# Altium schematic sheet APM9328_CONNECTORL.SchDoc: CONNECTOR L
size A4; Author: NC; Revision: 1.0; SheetNumber: 7; SheetTotal: 14
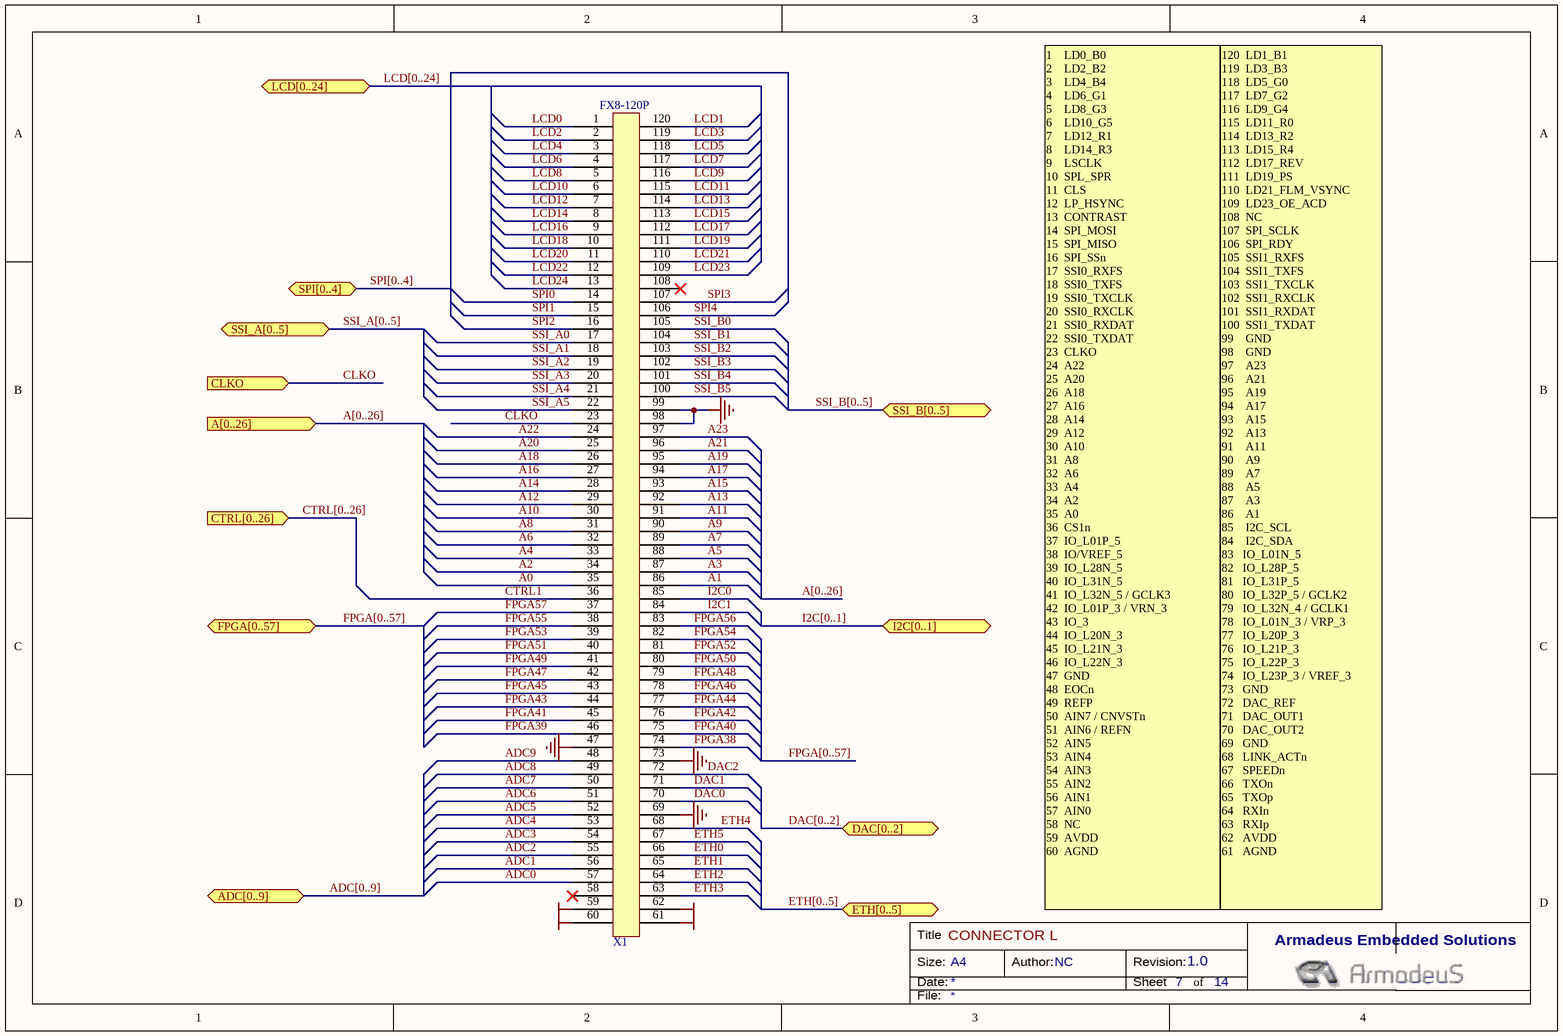
[diagram p0: APM9328_CONNECTORL.SchDoc]

## Parts
X1  FX8-120P  [FX8-120P]

## Ports
A[0..26] (in), ADC[0..9] (bidir), CLKO (in), CTRL[0..26] (in), DAC[0..2] (bidir), ETH[0..5] (bidir), FPGA[0..57] (bidir), I2C[0..1] (bidir), LCD[0..24] (bidir), SPI[0..4] (bidir), SSI_A[0..5] (bidir), SSI_B[0..5] (bidir)

## Nets
AGND: X1.60 X1.61
AVDD: X1.59 X1.62
GND: X1.47 X1.69 X1.73 X1.98 X1.99
A0: X1.35
A1: X1.86
A2: X1.34
A3: X1.87
A4: X1.33
A5: X1.88
A6: X1.32
A7: X1.89
A8: X1.31
A9: X1.90
A10: X1.30
A11: X1.91
A12: X1.29
A13: X1.92
A14: X1.28
A15: X1.93
A16: X1.27
A17: X1.94
A18: X1.26
A19: X1.95
A20: X1.25
A21: X1.96
A22: X1.24
A23: X1.97
ADC0: X1.57
ADC1: X1.56
ADC2: X1.55
ADC3: X1.54
ADC4: X1.53
ADC5: X1.52
ADC6: X1.51
ADC7: X1.50
ADC8: X1.49
ADC9: X1.48
CLKO: X1.23 ; port CLKO
CTRL1: X1.36
DAC0: X1.70
DAC1: X1.71
DAC2: X1.72
ETH0: X1.66
ETH1: X1.65
ETH2: X1.64
ETH3: X1.63
ETH4: X1.68
ETH5: X1.67
FPGA38: X1.74
FPGA39: X1.46
FPGA40: X1.75
FPGA41: X1.45
FPGA42: X1.76
FPGA43: X1.44
FPGA44: X1.77
FPGA45: X1.43
FPGA46: X1.78
FPGA47: X1.42
FPGA48: X1.79
FPGA49: X1.41
FPGA50: X1.80
FPGA51: X1.40
FPGA52: X1.81
FPGA53: X1.39
FPGA54: X1.82
FPGA55: X1.38
FPGA56: X1.83
FPGA57: X1.37
I2C0: X1.85
I2C1: X1.84
LCD0: X1.1
LCD1: X1.120
LCD2: X1.2
LCD3: X1.119
LCD4: X1.3
LCD5: X1.118
LCD6: X1.4
LCD7: X1.117
LCD8: X1.5
LCD9: X1.116
LCD10: X1.6
LCD11: X1.115
LCD12: X1.7
LCD13: X1.114
LCD14: X1.8
LCD15: X1.113
LCD16: X1.9
LCD17: X1.112
LCD18: X1.10
LCD19: X1.111
LCD20: X1.11
LCD21: X1.110
LCD22: X1.12
LCD23: X1.109
LCD24: X1.13
SPI0: X1.14
SPI1: X1.15
SPI2: X1.16
SPI3: X1.107
SPI4: X1.106
SSI_A0: X1.17
SSI_A1: X1.18
SSI_A2: X1.19
SSI_A3: X1.20
SSI_A4: X1.21
SSI_A5: X1.22
SSI_B0: X1.105
SSI_B1: X1.104
SSI_B2: X1.103
SSI_B3: X1.102
SSI_B4: X1.101
SSI_B5: X1.100

Not connected (* = marked no-connect by the designer): X1 58* 108*

## Buses and harness runs
bus A[0..26]
bus A[0..26] = port A[0..26]
bus ADC[0..9] = port ADC[0..9]
bus CTRL[0..26] = port CTRL[0..26]
bus DAC[0..2] = port DAC[0..2]
bus ETH[0..5] = port ETH[0..5]
bus FPGA[0..57]
bus FPGA[0..57] = port FPGA[0..57]
bus I2C[0..1] = port I2C[0..1]
bus LCD[0..24] = port LCD[0..24]
bus SPI[0..4] = port SPI[0..4]
bus SSI_A[0..5] = port SSI_A[0..5]
bus SSI_B[0..5] = port SSI_B[0..5]

## Notes on the sheet
- 1    LD0_B0
  2    LD2_B2
  3    LD4_B4
  4    LD6_G1
  5    LD8_G3
  6    LD10_G5
  7    LD12_R1
  8    LD14_R3
  9    LSCLK
  10  SPL_SPR
  11  CLS
  12  LP_HSYNC
  13  CONTRAST
  14  SPI_MOSI
  15  SPI_MISO
  16  SPI_SSn
  17  SSI0_RXFS
  18  SSI0_TXFS
  19  SSI0_TXCLK
  20  SSI0_RXCLK
  21  SSI0_RXDAT
  22  SSI0_TXDAT
  23  CLKO
  24  A22
  25  A20
  26  A18
  27  A16
  28  A14
  29  A12
  30  A10
  31  A8
  32  A6
  33  A4
  34  A2
  35  A0
  36  CS1n
  37  IO_L01P_5
  38  IO/VREF_5
  39  IO_L28N_5
  40  IO_L31N_5
  41  IO_L32N_5 / GCLK3
  42  IO_L01P_3 / VRN_3
  43  IO_3
  44  IO_L20N_3
  45  IO_L21N_3
  46  IO_L22N_3
  47  GND
  48  EOCn
  49  REFP
  50  AIN7 / CNVSTn
  51  AIN6 / REFN
  52  AIN5
  53  AIN4
  54  AIN3
  55  AIN2
  56  AIN1
  57  AIN0
  58  NC
  59  AVDD
  60  AGND
- 120  LD1_B1
  119  LD3_B3
  118  LD5_G0
  117  LD7_G2
  116  LD9_G4
  115  LD11_R0
  114  LD13_R2
  113  LD15_R4
  112  LD17_REV
  111  LD19_PS
  110  LD21_FLM_VSYNC
  109  LD23_OE_ACD
  108  NC
  107  SPI_SCLK
  106  SPI_RDY
  105  SSI1_RXFS
  104  SSI1_TXFS
  103  SSI1_TXCLK
  102  SSI1_RXCLK
  101  SSI1_RXDAT
  100  SSI1_TXDAT
  99    GND
  98    GND
  97    A23
  96    A21
  95    A19
  94    A17
  93    A15
  92    A13
  91    A11
  90    A9
  89    A7
  88    A5
  87    A3
  86    A1
  85    I2C_SCL
  84    I2C_SDA
  83   IO_L01N_5
  82   IO_L28P_5
  81   IO_L31P_5
  80   IO_L32P_5 / GCLK2
  79   IO_L32N_4 / GCLK1
  78   IO_L01N_3 / VRP_3
  77   IO_L20P_3
  76   IO_L21P_3
  75   IO_L22P_3
  74   IO_L23P_3 / VREF_3
  73   GND
  72   DAC_REF
  71   DAC_OUT1
  70   DAC_OUT2
  69   GND
  68   LINK_ACTn
  67   SPEEDn
  66   TXOn
  65   TXOp
  64   RXIn
  63   RXIp
  62   AVDD
  61   AGND
- Title
- Size:
- Date:
- A4
- Author:
- Revision:
- Sheet
- of
- Armadeus Embedded Solutions
- File:

## Library data of the parts
X1 = FX8-120P: Fine Pitch Connector; Manufacturer: Hirose; Part Number: FX8-120P-SV; Distributor: Digiley; Price_100: 2,25; Price_500: 1,688; Price_1000: 1,625